# EAGLE schematic CLOCK_1 (EAGLE 9.2.2)
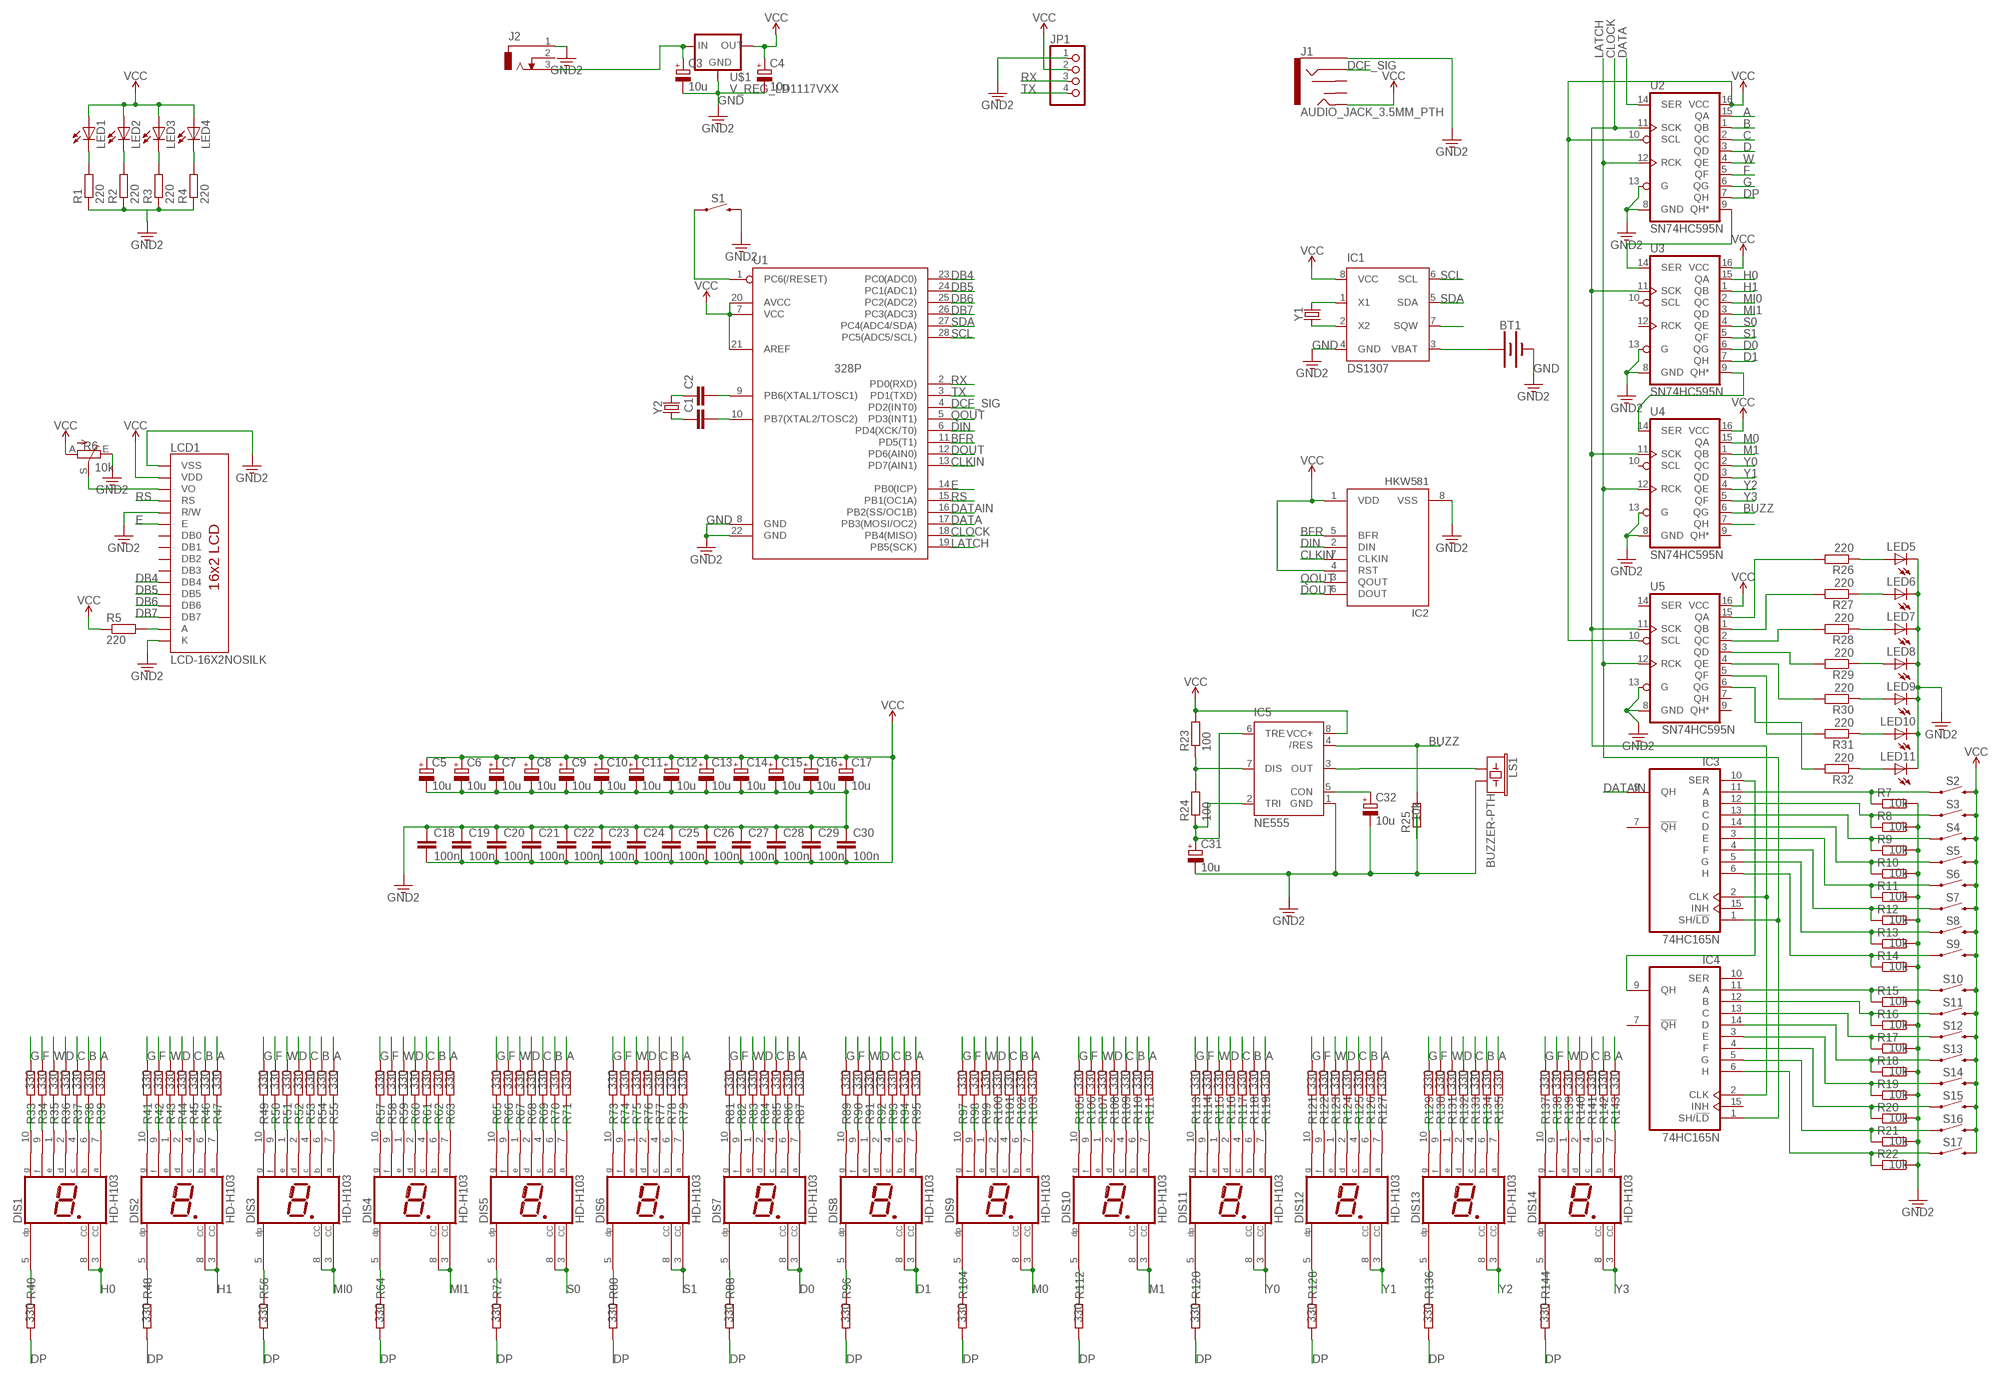
[diagram p0: schematic, sheet 1]

## Parts
BT1  BATTERY-20MM_PTH  [BATTCOM_20MM_PTH]
C1  C-EU025-025X050  [C025-025X050]
C2  C-EU025-025X050  [C025-025X050]
C3  10u  CPOL-EUE5-8.5  [E5-8,5]
C4  10u  CPOL-EUE5-8.5  [E5-8,5]
C5  10u  CPOL-EUE5-8.5  [E5-8,5]
C6  10u  CPOL-EUE5-8.5  [E5-8,5]
C7  10u  CPOL-EUE5-8.5  [E5-8,5]
C8  10u  CPOL-EUE5-8.5  [E5-8,5]
C9  10u  CPOL-EUE5-8.5  [E5-8,5]
C10  10u  CPOL-EUE5-8.5  [E5-8,5]
C11  10u  CPOL-EUE5-8.5  [E5-8,5]
C12  10u  CPOL-EUE5-8.5  [E5-8,5]
C13  10u  CPOL-EUE5-8.5  [E5-8,5]
C14  10u  CPOL-EUE5-8.5  [E5-8,5]
C15  10u  CPOL-EUE5-8.5  [E5-8,5]
C16  10u  CPOL-EUE5-8.5  [E5-8,5]
C17  10u  CPOL-EUE5-8.5  [E5-8,5]
C18  100n  C-EU025-025X050  [C025-025X050]
C19  100n  C-EU025-025X050  [C025-025X050]
C20  100n  C-EU025-025X050  [C025-025X050]
C21  100n  C-EU025-025X050  [C025-025X050]
C22  100n  C-EU025-025X050  [C025-025X050]
C23  100n  C-EU025-025X050  [C025-025X050]
C24  100n  C-EU025-025X050  [C025-025X050]
C25  100n  C-EU025-025X050  [C025-025X050]
C26  100n  C-EU025-025X050  [C025-025X050]
C27  100n  C-EU025-025X050  [C025-025X050]
C28  100n  C-EU025-025X050  [C025-025X050]
C29  100n  C-EU025-025X050  [C025-025X050]
C30  100n  C-EU025-025X050  [C025-025X050]
C31  10u  CPOL-EUE5-8.5  [E5-8,5]
C32  10u  CPOL-EUE5-8.5  [E5-8,5]
DIS1  HD-H103  [HDSP-M]
DIS2  HD-H103  [HDSP-M]
DIS3  HD-H103  [HDSP-M]
DIS4  HD-H103  [HDSP-M]
DIS5  HD-H103  [HDSP-M]
DIS6  HD-H103  [HDSP-M]
DIS7  HD-H103  [HDSP-M]
DIS8  HD-H103  [HDSP-M]
DIS9  HD-H103  [HDSP-M]
DIS10  HD-H103  [HDSP-M]
DIS11  HD-H103  [HDSP-M]
DIS12  HD-H103  [HDSP-M]
DIS13  HD-H103  [HDSP-M]
DIS14  HD-H103  [HDSP-M]
IC1  DS1307  [DIL08]
IC2  HKW581  MCP79412X/MSOP  [MSOP8_065]
IC3  74HC165N  [DIL16]
IC4  74HC165N  [DIL16]
IC5  NE555  [DIL-08]
J1  AUDIO_JACK_3.5MM_PTH  [AUDIO-JACK]
J2  DCJ0303  [DCJ0303]
JP1  PINHD-1X4  [1X04]
LCD1  LCD-16X2NOSILK  [LCD-16X2_NOSILK]
LED1  LED5MM  [LED5MM]
LED2  LED5MM  [LED5MM]
LED3  LED5MM  [LED5MM]
LED4  LED5MM  [LED5MM]
LED5  LED5MM  [LED5MM]
LED6  LED5MM  [LED5MM]
LED7  LED5MM  [LED5MM]
LED8  LED5MM  [LED5MM]
LED9  LED5MM  [LED5MM]
LED10  LED5MM  [LED5MM]
LED11  LED5MM  [LED5MM]
LS1  BUZZER-PTH  [BUZZER-12MM]
R1  220  R-EU_0207/10  [0207/10]
R2  220  R-EU_0207/10  [0207/10]
R3  220  R-EU_0207/10  [0207/10]
R4  220  R-EU_0207/10  [0207/10]
R5  220  R-EU_0207/10  [0207/10]
R6  10k  TRIM_EU-B25U  [B25U]
R7  10k  R-EU_0207/10  [0207/10]
R8  10k  R-EU_0207/10  [0207/10]
R9  10k  R-EU_0207/10  [0207/10]
R10  10k  R-EU_0207/10  [0207/10]
R11  10k  R-EU_0207/10  [0207/10]
R12  10k  R-EU_0207/10  [0207/10]
R13  10k  R-EU_0207/10  [0207/10]
R14  10k  R-EU_0207/10  [0207/10]
R15  10k  R-EU_0207/10  [0207/10]
R16  10k  R-EU_0207/10  [0207/10]
R17  10k  R-EU_0207/10  [0207/10]
R18  10k  R-EU_0207/10  [0207/10]
R19  10k  R-EU_0207/10  [0207/10]
R20  10k  R-EU_0207/10  [0207/10]
R21  10k  R-EU_0207/10  [0207/10]
R22  10k  R-EU_0207/10  [0207/10]
R23  100  R-EU_0207/10  [0207/10]
R24  100  R-EU_0207/10  [0207/10]
R25  10k  R-EU_0207/10  [0207/10]
R26  220  R-EU_0207/10  [0207/10]
R27  220  R-EU_0207/10  [0207/10]
R28  220  R-EU_0207/10  [0207/10]
R29  220  R-EU_0207/10  [0207/10]
R30  220  R-EU_0207/10  [0207/10]
R31  220  R-EU_0207/10  [0207/10]
R32  220  R-EU_0207/10  [0207/10]
R33  330  R-EU_0207/10  [0207/10]
R34  330  R-EU_0207/10  [0207/10]
R35  330  R-EU_0207/10  [0207/10]
R36  330  R-EU_0207/10  [0207/10]
R37  330  R-EU_0207/10  [0207/10]
R38  330  R-EU_0207/10  [0207/10]
R39  330  R-EU_0207/10  [0207/10]
R40  330  R-EU_0207/10  [0207/10]
R41  330  R-EU_0207/10  [0207/10]
R42  330  R-EU_0207/10  [0207/10]
R43  330  R-EU_0207/10  [0207/10]
R44  330  R-EU_0207/10  [0207/10]
R45  330  R-EU_0207/10  [0207/10]
R46  330  R-EU_0207/10  [0207/10]
R47  330  R-EU_0207/10  [0207/10]
R48  330  R-EU_0207/10  [0207/10]
R49  330  R-EU_0207/10  [0207/10]
R50  330  R-EU_0207/10  [0207/10]
R51  330  R-EU_0207/10  [0207/10]
R52  330  R-EU_0207/10  [0207/10]
R53  330  R-EU_0207/10  [0207/10]
R54  330  R-EU_0207/10  [0207/10]
R55  330  R-EU_0207/10  [0207/10]
R56  330  R-EU_0207/10  [0207/10]
R57  330  R-EU_0207/10  [0207/10]
R58  330  R-EU_0207/10  [0207/10]
R59  330  R-EU_0207/10  [0207/10]
R60  330  R-EU_0207/10  [0207/10]
R61  330  R-EU_0207/10  [0207/10]
R62  330  R-EU_0207/10  [0207/10]
R63  330  R-EU_0207/10  [0207/10]
R64  330  R-EU_0207/10  [0207/10]
R65  330  R-EU_0207/10  [0207/10]
R66  330  R-EU_0207/10  [0207/10]
R67  330  R-EU_0207/10  [0207/10]
R68  330  R-EU_0207/10  [0207/10]
R69  330  R-EU_0207/10  [0207/10]
R70  330  R-EU_0207/10  [0207/10]
R71  330  R-EU_0207/10  [0207/10]
R72  330  R-EU_0207/10  [0207/10]
R73  330  R-EU_0207/10  [0207/10]
R74  330  R-EU_0207/10  [0207/10]
R75  330  R-EU_0207/10  [0207/10]
R76  330  R-EU_0207/10  [0207/10]
R77  330  R-EU_0207/10  [0207/10]
R78  330  R-EU_0207/10  [0207/10]
R79  330  R-EU_0207/10  [0207/10]
R80  330  R-EU_0207/10  [0207/10]
R81  330  R-EU_0207/10  [0207/10]
R82  330  R-EU_0207/10  [0207/10]
R83  330  R-EU_0207/10  [0207/10]
R84  330  R-EU_0207/10  [0207/10]
R85  330  R-EU_0207/10  [0207/10]
R86  330  R-EU_0207/10  [0207/10]
R87  330  R-EU_0207/10  [0207/10]
R88  330  R-EU_0207/10  [0207/10]
R89  330  R-EU_0207/10  [0207/10]
R90  330  R-EU_0207/10  [0207/10]
R91  330  R-EU_0207/10  [0207/10]
R92  330  R-EU_0207/10  [0207/10]
R93  330  R-EU_0207/10  [0207/10]
R94  330  R-EU_0207/10  [0207/10]
R95  330  R-EU_0207/10  [0207/10]
R96  330  R-EU_0207/10  [0207/10]
R97  330  R-EU_0207/10  [0207/10]
R98  330  R-EU_0207/10  [0207/10]
R99  330  R-EU_0207/10  [0207/10]
R100  330  R-EU_0207/10  [0207/10]
R101  330  R-EU_0207/10  [0207/10]
R102  330  R-EU_0207/10  [0207/10]
R103  330  R-EU_0207/10  [0207/10]
R104  330  R-EU_0207/10  [0207/10]
R105  330  R-EU_0207/10  [0207/10]
R106  330  R-EU_0207/10  [0207/10]
R107  330  R-EU_0207/10  [0207/10]
R108  330  R-EU_0207/10  [0207/10]
R109  330  R-EU_0207/10  [0207/10]
R110  330  R-EU_0207/10  [0207/10]
R111  330  R-EU_0207/10  [0207/10]
R112  330  R-EU_0207/10  [0207/10]
R113  330  R-EU_0207/10  [0207/10]
R114  330  R-EU_0207/10  [0207/10]
R115  330  R-EU_0207/10  [0207/10]
R116  330  R-EU_0207/10  [0207/10]
R117  330  R-EU_0207/10  [0207/10]
R118  330  R-EU_0207/10  [0207/10]
R119  330  R-EU_0207/10  [0207/10]
R120  330  R-EU_0207/10  [0207/10]
R121  330  R-EU_0207/10  [0207/10]
R122  330  R-EU_0207/10  [0207/10]
R123  330  R-EU_0207/10  [0207/10]
R124  330  R-EU_0207/10  [0207/10]
R125  330  R-EU_0207/10  [0207/10]
R126  330  R-EU_0207/10  [0207/10]
R127  330  R-EU_0207/10  [0207/10]
R128  330  R-EU_0207/10  [0207/10]
R129  330  R-EU_0207/10  [0207/10]
R130  330  R-EU_0207/10  [0207/10]
R131  330  R-EU_0207/10  [0207/10]
R132  330  R-EU_0207/10  [0207/10]
R133  330  R-EU_0207/10  [0207/10]
R134  330  R-EU_0207/10  [0207/10]
R135  330  R-EU_0207/10  [0207/10]
R136  330  R-EU_0207/10  [0207/10]
R137  330  R-EU_0207/10  [0207/10]
R138  330  R-EU_0207/10  [0207/10]
R139  330  R-EU_0207/10  [0207/10]
R140  330  R-EU_0207/10  [0207/10]
R141  330  R-EU_0207/10  [0207/10]
R142  330  R-EU_0207/10  [0207/10]
R143  330  R-EU_0207/10  [0207/10]
R144  330  R-EU_0207/10  [0207/10]
S1  MOMENTARY-SWITCH-SPST-PTH-6.0MM  [TACTILE_SWITCH_PTH_6.0MM]
S2  MOMENTARY-SWITCH-SPST-PTH-6.0MM  [TACTILE_SWITCH_PTH_6.0MM]
S3  MOMENTARY-SWITCH-SPST-PTH-6.0MM  [TACTILE_SWITCH_PTH_6.0MM]
S4  MOMENTARY-SWITCH-SPST-PTH-6.0MM  [TACTILE_SWITCH_PTH_6.0MM]
S5  MOMENTARY-SWITCH-SPST-PTH-6.0MM  [TACTILE_SWITCH_PTH_6.0MM]
S6  MOMENTARY-SWITCH-SPST-PTH-6.0MM  [TACTILE_SWITCH_PTH_6.0MM]
S7  MOMENTARY-SWITCH-SPST-PTH-6.0MM  [TACTILE_SWITCH_PTH_6.0MM]
S8  MOMENTARY-SWITCH-SPST-PTH-6.0MM  [TACTILE_SWITCH_PTH_6.0MM]
S9  MOMENTARY-SWITCH-SPST-PTH-6.0MM  [TACTILE_SWITCH_PTH_6.0MM]
S10  MOMENTARY-SWITCH-SPST-PTH-6.0MM  [TACTILE_SWITCH_PTH_6.0MM]
S11  MOMENTARY-SWITCH-SPST-PTH-6.0MM  [TACTILE_SWITCH_PTH_6.0MM]
S12  MOMENTARY-SWITCH-SPST-PTH-6.0MM  [TACTILE_SWITCH_PTH_6.0MM]
S13  MOMENTARY-SWITCH-SPST-PTH-6.0MM  [TACTILE_SWITCH_PTH_6.0MM]
S14  MOMENTARY-SWITCH-SPST-PTH-6.0MM  [TACTILE_SWITCH_PTH_6.0MM]
S15  MOMENTARY-SWITCH-SPST-PTH-6.0MM  [TACTILE_SWITCH_PTH_6.0MM]
S16  MOMENTARY-SWITCH-SPST-PTH-6.0MM  [TACTILE_SWITCH_PTH_6.0MM]
S17  MOMENTARY-SWITCH-SPST-PTH-6.0MM  [TACTILE_SWITCH_PTH_6.0MM]
U1  328P  ATMEGA328P_PDIP  [DIP28]
U2  SN74HC595N  74HC595N  [DIP16]
U3  SN74HC595N  74HC595N  [DIP16]
U4  SN74HC595N  74HC595N  [DIP16]
U5  SN74HC595N  74HC595N  [DIP16]
U$1  V_REG_LD1117VXX  [78XXL]
Y1  CRYSTALPTH-2X6  [CRYSTAL-PTH-2X6-CYL]
Y2  CRYSTALPTH-HC49UV  [HC49U]

## Nets
3.3V: J1.SLEEVE ; supply symbol labelled GND2
A: R39.2 R47.2 R55.2 R63.2 R71.2 R79.2 R87.2 R95.2 R103.2 R111.2 R119.2 R127.2 R135.2 R143.2 U2.15(QA)
B: R38.2 R46.2 R54.2 R62.2 R70.2 R78.2 R86.2 R94.2 R102.2 R110.2 R118.2 R126.2 R134.2 R142.2 U2.1(QB)
BFR: IC2.5(BFR) U1.11(PD5(T1))
BUZZ: IC5.4(/RES) R25.2 U4.6(QG)
C: R37.2 R45.2 R53.2 R61.2 R69.2 R77.2 R85.2 R93.2 R101.2 R109.2 R117.2 R125.2 R133.2 R141.2 U2.2(QC)
CLKIN: IC2.7(CLKIN) U1.13(PD7(AIN1))
CLOCK: IC3.2(CLK) IC4.2(CLK) U1.18(PB4(MISO)) U2.11(SCK) U3.11(SCK) U4.11(SCK) U5.11(SCK)
D: R36.2 R44.2 R52.2 R60.2 R68.2 R76.2 R84.2 R92.2 R100.2 R108.2 R116.2 R124.2 R132.2 R140.2 U2.3(QD)
D0: DIS7.3(CC) DIS7.8(CC) U3.6(QG)
D1: DIS8.3(CC) DIS8.8(CC) U3.7(QH)
DATA: U1.17(PB3(MOSI/OC2)) U2.14(SER)
DATAIN: IC3.9(QH) U1.16(PB2(SS/OC1B))
DB4: LCD1.11(DB4) U1.23(PC0(ADC0))
DB5: LCD1.12(DB5) U1.24(PC1(ADC1))
DB6: LCD1.13(DB6) U1.25(PC2(ADC2))
DB7: LCD1.14(DB7) U1.26(PC3(ADC3))
DCF_SIG: J1.RING U1.4(PD2(INT0))
DIN: IC2.2(DIN) U1.6(PD4(XCK/T0))
DOUT: IC2.6(DOUT) U1.12(PD6(AIN0))
DP: R40.1 R48.1 R56.1 R64.1 R72.1 R80.1 R88.1 R96.1 R104.1 R112.1 R120.1 R128.1 R136.1 R144.1 U2.7(QH)
E: LCD1.6(E) U1.14(PB0(ICP))
F: R34.2 R42.2 R50.2 R58.2 R66.2 R74.2 R82.2 R90.2 R98.2 R106.2 R114.2 R122.2 R130.2 R138.2 U2.5(QF)
G: R33.2 R41.2 R49.2 R57.2 R65.2 R73.2 R81.2 R89.2 R97.2 R105.2 R113.2 R121.2 R129.2 R137.2 U2.6(QG)
GND: BT1.2(-) C3.- C4.- C5.- C6.- C7.- C8.- C9.- C10.- C11.- C12.- C13.- C14.- C15.- C16.- C17.- C18.1 C19.1 C20.1 C21.1 C22.1 C23.1 C24.1 C25.1 C26.1 C27.1 C28.1 C29.1 C30.1 C31.- C32.- IC1.4(GND) IC2.8(VSS) IC5.1(GND) J2.1 JP1.1 LCD1.1(VSS) LCD1.5(R/W) LCD1.16(K) LED5.K(C) LED6.K(C) LED7.K(C) LED8.K(C) LED9.K(C) LED10.K(C) LED11.K(C) LS1.- R1.1 R2.1 R3.1 R4.1 R6.E R7.2 R8.2 R9.2 R10.2 R11.2 R12.2 R13.2 R14.2 R15.2 R16.2 R17.2 R18.2 R19.2 R20.2 R21.2 R22.2 R25.1 S1.3 U1.8(GND) U1.22(GND) U2.8(GND) U2.13(G) U3.8(GND) U3.13(G) U4.8(GND) U4.13(G) U5.8(GND) U5.13(G) U$1.IN(GND) ; supply symbol labelled GND2
H0: DIS1.3(CC) DIS1.8(CC) U3.15(QA)
H1: DIS2.3(CC) DIS2.8(CC) U3.1(QB)
LATCH: IC3.1(SH/!LD) IC4.1(SH/!LD) U1.19(PB5(SCK)) U2.12(RCK) U4.12(RCK) U5.12(RCK)
M0: DIS9.3(CC) DIS9.8(CC) U4.15(QA)
M1: DIS10.3(CC) DIS10.8(CC) U4.1(QB)
MI0: DIS3.3(CC) DIS3.8(CC) U3.2(QC)
MI1: DIS4.3(CC) DIS4.8(CC) U3.3(QD)
N$1: C3.+ J2.3 U$1.OUT(IN)
N$2: LED3.K(C) R3.2
N$3: S1.1 U1.1(PC6(/RESET))
N$4: IC3.10(SER) IC4.9(QH)
N$5: LED1.K(C) R1.2
N$6: LED2.K(C) R2.2
N$7: IC1.1(X1) Y1.2
N$8: IC1.2(X2) Y1.1
N$9: LED4.K(C) R4.2
N$10: U2.9(QH*) U3.14(SER)
N$11: IC1.7(SQW)
N$12: BT1.1(+) IC1.3(VBAT)
N$13: C2.2 U1.9(PB6(XTAL1/TOSC1))
N$14: C1.2 U1.10(PB7(XTAL2/TOSC2))
N$15: C1.1 Y2.1
N$16: C2.1 Y2.2
N$17: U3.9(QH*) U4.14(SER)
N$19: IC3.11(A) R7.1 S2.1
N$20: IC3.12(B) R8.1 S3.1
N$21: LCD1.15(A) R5.2
N$22: IC3.13(C) R9.1 S4.1
N$23: IC3.14(D) R10.1 S5.1
N$24: IC3.3(E) R11.1 S6.1
N$25: IC3.4(F) R12.1 S7.1
N$26: IC3.5(G) R13.1 S8.1
N$27: IC3.6(H) R14.1 S9.1
N$28: IC4.11(A) R15.1 S10.1
N$29: IC4.12(B) R16.1 S11.1
N$30: IC4.13(C) R17.1 S12.1
N$31: IC4.14(D) R18.1 S13.1
N$32: LCD1.3(VO) R6.S
N$33: IC4.3(E) R19.1 S14.1
N$34: IC4.4(F) R20.1 S15.1
N$35: IC4.5(G) R21.1 S16.1
N$36: IC4.6(H) R22.1 S17.1
N$37: IC5.7(DIS) R23.1 R24.2
N$38: C31.+ IC5.2(TRI) IC5.6(TRE) R24.1
N$39: C32.+ IC5.5(CON)
N$41: R26.2 U5.15(QA)
N$42: IC5.3(OUT) LS1.+
N$43: R27.2 U5.1(QB)
N$44: R28.2 U5.2(QC)
N$45: R29.2 U5.3(QD)
N$46: R30.2 U5.4(QE)
N$47: R31.2 U5.5(QF)
N$48: R32.2 U5.6(QG)
N$49: LED5.A R26.1
N$50: LED6.A R27.1
N$51: LED7.A R28.1
N$52: LED8.A R29.1
N$53: LED9.A R30.1
N$54: LED10.A R31.1
N$55: LED11.A R32.1
N$57: DIS2.10(G) R41.1
N$58: DIS2.9(F) R42.1
N$59: DIS2.1(E) R43.1
N$60: DIS2.2(D) R44.1
N$61: DIS2.4(C) R45.1
N$62: DIS2.6(B) R46.1
N$63: DIS2.7(A) R47.1
N$64: DIS1.10(G) R33.1
N$65: DIS1.9(F) R34.1
N$66: DIS1.1(E) R35.1
N$67: DIS1.2(D) R36.1
N$68: DIS1.4(C) R37.1
N$69: DIS1.6(B) R38.1
N$70: DIS1.7(A) R39.1
N$71: DIS2.5(DP) R48.2
N$73: DIS3.10(G) R49.1
N$74: DIS3.9(F) R50.1
N$75: DIS3.1(E) R51.1
N$76: DIS3.2(D) R52.1
N$77: DIS3.4(C) R53.1
N$78: DIS1.5(DP) R40.2
N$79: DIS3.6(B) R54.1
N$80: DIS3.7(A) R55.1
N$81: DIS3.5(DP) R56.2
N$83: DIS4.10(G) R57.1
N$84: DIS4.9(F) R58.1
N$85: DIS4.1(E) R59.1
N$86: DIS4.2(D) R60.1
N$87: DIS4.4(C) R61.1
N$88: DIS4.6(B) R62.1
N$89: DIS4.7(A) R63.1
N$90: DIS4.5(DP) R64.2
N$92: DIS5.10(G) R65.1
N$93: DIS5.9(F) R66.1
N$94: DIS5.1(E) R67.1
N$95: DIS5.2(D) R68.1
N$96: DIS5.4(C) R69.1
N$97: DIS5.6(B) R70.1
N$98: DIS5.7(A) R71.1
N$99: DIS5.5(DP) R72.2
N$101: DIS6.10(G) R73.1
N$102: DIS6.9(F) R74.1
N$103: DIS6.1(E) R75.1
N$104: DIS6.2(D) R76.1
N$105: DIS6.4(C) R77.1
N$106: DIS6.6(B) R78.1
N$107: DIS6.7(A) R79.1
N$108: DIS6.5(DP) R80.2
N$110: DIS7.10(G) R81.1
N$111: DIS7.9(F) R82.1
N$112: DIS7.1(E) R83.1
N$113: DIS7.2(D) R84.1
N$114: DIS7.4(C) R85.1
N$115: DIS7.6(B) R86.1
N$116: DIS7.7(A) R87.1
N$117: DIS7.5(DP) R88.2
N$119: DIS8.10(G) R89.1
N$120: DIS8.9(F) R90.1
N$121: DIS8.1(E) R91.1
N$122: DIS8.2(D) R92.1
N$123: DIS8.4(C) R93.1
N$124: DIS8.6(B) R94.1
N$125: DIS8.7(A) R95.1
N$126: DIS8.5(DP) R96.2
N$128: DIS9.10(G) R97.1
N$129: DIS9.9(F) R98.1
N$130: DIS9.1(E) R99.1
N$131: DIS9.2(D) R100.1
N$132: DIS9.4(C) R101.1
N$133: DIS9.6(B) R102.1
N$134: DIS9.7(A) R103.1
N$135: DIS9.5(DP) R104.2
N$137: DIS10.10(G) R105.1
N$138: DIS10.9(F) R106.1
N$139: DIS10.1(E) R107.1
N$140: DIS10.2(D) R108.1
N$141: DIS10.4(C) R109.1
N$142: DIS10.6(B) R110.1
N$143: DIS10.7(A) R111.1
N$144: DIS10.5(DP) R112.2
N$146: DIS11.10(G) R113.1
N$147: DIS11.9(F) R114.1
N$148: DIS11.1(E) R115.1
N$149: DIS11.2(D) R116.1
N$150: DIS11.4(C) R117.1
N$151: DIS11.6(B) R118.1
N$152: DIS11.7(A) R119.1
N$153: DIS11.5(DP) R120.2
N$155: DIS12.10(G) R121.1
N$156: DIS12.9(F) R122.1
N$157: DIS12.1(E) R123.1
N$158: DIS12.2(D) R124.1
N$159: DIS12.4(C) R125.1
N$160: DIS12.6(B) R126.1
N$161: DIS12.7(A) R127.1
N$162: DIS12.5(DP) R128.2
N$164: DIS13.10(G) R129.1
N$165: DIS13.9(F) R130.1
N$166: DIS13.1(E) R131.1
N$167: DIS13.2(D) R132.1
N$168: DIS13.4(C) R133.1
N$169: DIS13.6(B) R134.1
N$170: DIS13.7(A) R135.1
N$171: DIS13.5(DP) R136.2
N$173: DIS14.10(G) R137.1
N$174: DIS14.9(F) R138.1
N$175: DIS14.1(E) R139.1
N$176: DIS14.2(D) R140.1
N$177: DIS14.4(C) R141.1
N$178: DIS14.6(B) R142.1
N$179: DIS14.7(A) R143.1
N$180: DIS14.5(DP) R144.2
N$197: U4.7(QH)
QOUT: IC2.3(QOUT) U1.5(PD3(INT1))
RS: LCD1.4(RS) U1.15(PB1(OC1A))
RX: JP1.3 U1.2(PD0(RXD))
S0: DIS5.3(CC) DIS5.8(CC) U3.4(QE)
S1: DIS6.3(CC) DIS6.8(CC) U3.5(QF)
SCL: IC1.6(SCL) U1.28(PC5(ADC5/SCL))
SDA: IC1.5(SDA) U1.27(PC4(ADC4/SDA))
TX: JP1.4 U1.3(PD1(TXD))
VCC: C4.+ C5.+ C6.+ C7.+ C8.+ C9.+ C10.+ C11.+ C12.+ C13.+ C14.+ C15.+ C16.+ C17.+ C18.2 C19.2 C20.2 C21.2 C22.2 C23.2 C24.2 C25.2 C26.2 C27.2 C28.2 C29.2 C30.2 IC1.8(VCC) IC2.1(VDD) IC2.4(RST) IC5.8(VCC+) J1.TIP JP1.2 LCD1.2(VDD) LED1.A LED2.A LED3.A LED4.A R5.1 R6.A R23.2 S2.3 S3.3 S4.3 S5.3 S6.3 S7.3 S8.3 S9.3 S10.3 S11.3 S12.3 S13.3 S14.3 S15.3 S16.3 S17.3 U1.7(VCC) U1.20(AVCC) U1.21(AREF) U2.10(SCL) U2.16(VCC) U3.16(VCC) U4.16(VCC) U5.10(SCL) U5.16(VCC) U$1.GND(OUT)
W: R35.2 R43.2 R51.2 R59.2 R67.2 R75.2 R83.2 R91.2 R99.2 R107.2 R115.2 R123.2 R131.2 R139.2 U2.4(QE)
Y0: DIS11.3(CC) DIS11.8(CC) U4.2(QC)
Y1: DIS12.3(CC) DIS12.8(CC) U4.3(QD)
Y2: DIS13.3(CC) DIS13.8(CC) U4.4(QE)
Y3: DIS14.3(CC) DIS14.8(CC) U4.5(QF)
Unconnected: IC3.7(!QH) IC3.15(INH) IC4.7(!QH) IC4.10(SER) IC4.15(INH) J1.RSH J1.TSH J2.2 LCD1.7(DB0) LCD1.8(DB1) LCD1.9(DB2) LCD1.10(DB3) U3.10(SCL) U3.12(RCK) U4.9(QH*) U4.10(SCL) U5.7(QH) U5.9(QH*) U5.14(SER)

## Power pins joined to a net without a drawn wire
GND: IC3.8(GND) IC4.8(GND)
VCC: IC3.16(VCC) IC4.16(VCC)

## Library data of the parts
BT1 = SparkFun-Batteries:BATTERY: Battery - Single Cell A variety of battery chemistries, sizes, and footprints. Device List: 20MM_PTH - Coin Cell Battery Holder - 20mm (PTH) <https://www.sparkfun.com/products/783> 6.8MM_PTH - Coin Cell Battery Holder - 6.8MM(SMD) <https://www.digikey.com/product-detail/en/seiko-instruments/MS621FE-FL11E/728-1057-ND/1889208?WT.srch=1&gclid=CNOQ5a6LzdQCFZS2wAodXCkE0g> 12MM_SMD - Coin Cell Battery Holder - 12mm (SMD) <https://www.sparkfun.com/products/10592> 12MM_PTH - Coin Cell Battery Holder - 12mm (PTH) <https://www.sparkfun.com/products/7948> 20MM_SMD - 20mm Coin Cell Battery Holder (SMD) (2 legs) Used on the Big Time Watch Kit <https://www.sparkfun.com/products/11734> 20MM_SMD_4LEGS - Coin Cell Battery Holder - 20mm (SMD) <https://www.sparkfun.com/products/11892> 20MM_SMD_4LEGS_OVERPASTE - Coin Cell Battery Holder - 20mm (SMD) <https://www.sparkfun.com/products/11892> (Over-paste on the legs) 24.5MM_PTH - Coin Cell Battery Holder - 24.5mm (PTH) <https://www.sparkfun.com/products/8863> 9V - 9V Battery Holder - PC Mount Used on the SparkFun SparkPunk Sound Kit <https://www.sparkfun.com/products/11177> and SparkFun SparkPunk Sequencer Kit <https://www.sparkfun.com/products/12707> 18650 - Battery Holder - 18650 (PTH) <https://www.sparkfun.com/products/13113> AA - Battery Holder - 1xAA (PTH) <https://www.sparkfun.com/products/7949> AAA - Battery Holder - 1xAAA (PTH) <https://www.sparkfun.com/products/12718> AA_KIT - Battery Holder - 1xAA (PTH) <https://www.sparkfun.com/products/7949> Special kit package - pads only have exposed copper on one side of the board. AAA_KIT - Battery Holder - 1xAAA (PTH) <https://www.sparkfun.com/products/12718> Special kit package - pads only have exposed copper on one side of the board.; PROD_ID: BATT-09031; SF_SKU: PRT-00783
C1 C2 C18-C30 = rcl:C-EU: CAPACITOR, European symbol; SPICEPREFIX: C
C3-C17 C31 C32 = rcl:CPOL-EU: POLARIZED CAPACITOR, European symbol; SPICEPREFIX: C
DIS1-DIS14 = display-hp:HD-H103: LED DISPLAY 1-character 7 segment, decimal point right; OC_FARNELL: unknown; OC_NEWARK: unknown
IC1 = ds1307_pcf8583:DS1307: I2C-Bus CLOCK/CALENDAR
IC2 = HKW581:MCP7941*?: Microchip MCP79410 / MCP79411 / MCP79412 I²C Real Time CLock/Calendar with Unique ID Rev. 5.0.0 as of 2013-10-23, for EAGLE 5+ Changelog 5.0.0 (initial) MCP79410XI/YY X: Unique ID 0: blank 1: EUI-48 2: EUI-96 I: Temperature Range (Industrial) /YY: Package /MS: MSOP8_.65 (8-Lead Micro Small Outline Package, 0.65mm pitch) /SN: SOIC8 (8-Lead Small Outline [Narrow], 3.9mm body) /ST: TSSOP8 (8-Lead Thin Schrink Small Outline, 4.4mm body) Source: http://www.microchip.com Author: Dipl.-Ing. FH Rainer Bayer Heilbronn University HHN http://www.hs-heilbronn.de/rainer.bayer · rainer.bayer@hs-heilbronn.de Engineering office ing-rb: http://www.ing-rb.de/ · eagle@ing-rb.de Lectureship dozent-rb: http://www.dozent-rb.de/ · eagle@dozent-rb.de; SPICEPREFIX: X
IC3 IC4 = 74xx-eu:74*165: 8-bit parallel load SHIFT REGISTER
IC5 = st-microelectronics:NE555: General purpose bipolar Timer; MF: Arrow Electronics; MPN: NE555N; OC_FARNELL: 1467742; OC_NEWARK: 89K1486
J1 = SparkFun-Connectors:AUDIO_JACK_3.5MM: Audio Jack 3.5mm variants of PTH and SMT stereo audio jack with bypass switches. SparkFun Products: SparkFun SparkPunk Sound Kit <[https://www.sparkfun.com/products/11177]> - PTH MP3 Trigger <https://www.sparkfun.com/products/13720> -3.5mm SMD SparkFun PicoBoard <https://www.sparkfun.com/products/11888>- 2.5mm SMD; PROD_ID: CONN-08774; SF_ID: PRT-08032
J2 = con-jack:DCJ0303: DC POWER JACK Source: DCJ0303.pdf; OC_FARNELL: unknown; OC_NEWARK: unknown
JP1 = pinhead:PINHD-1X4: PIN HEADER
LCD1 = SparkFun-Displays:LCD-16X2: Standard text-only 16x2 parallel input LCD Basic 16 character by 2 line display. Typically utilizes the extremely common HD44780 parallel interface chipset SparkFun Products: Basic 16x2 Green <https://www.sparkfun.com/products/255> Basic 8x2 Green <https://www.sparkfun.com/products/11122>; SF_ID: LCD-00255
LED1-LED11 = led:LED: LED OSRAM: - CHIPLED LG R971, LG N971, LY N971, LG Q971, LY Q971, LO R971, LY R971 LH N974, LH R974 LS Q976, LO Q976, LY Q976 LO Q996 - Hyper CHIPLED LW Q18S LB Q993, LB Q99A, LB R99A - SideLED LS A670, LO A670, LY A670, LG A670, LP A670 LB A673, LV A673, LT A673, LW A673 LH A674 LY A675 LS A676, LA A676, LO A676, LY A676, LW A676 LS A679, LY A679, LG A679 - Hyper Micro SIDELED® LS Y876, LA Y876, LO Y876, LY Y876 LT Y87S - SmartLED LW L88C, LW L88S LB L89C, LB L89S, LG L890 LS L89K, LO L89K, LY L89K LS L896, LA L896, LO L896, LY L896 - TOPLED LS T670, LO T670, LY T670, LG T670, LP T670 LSG T670, LSP T670, LSY T670, LOP T670, LYG T670 LG T671, LOG T671, LSG T671 LB T673, LV T673, LT T673, LW T673 LH T674 LS T676, LA T676, LO T676, LY T676, LB T676, LH T676, LSB T676, LW T676 LB T67C, LV T67C, LT T67C, LS T67K, LO T67K, LY T67K, LW E67C LS E67B, LA E67B, LO E67B, LY E67B, LB E67C, LV E67C, LT E67C LW T67C LS T679, LY T679, LG T679 LS T770, LO T770, LY T770, LG T770, LP T770 LB T773, LV T773, LT T773, LW T773 LH T774 LS E675, LA E675, LY E675, LS T675 LS T776, LA T776, LO T776, LY T776, LB T776 LHGB T686 LT T68C, LB T68C - Hyper Mini TOPLED® LB M676 - Mini TOPLED Santana® LG M470 LS M47K, LO M47K, LY M47K Source: http://www.osram.convergy.de LUXEON: - LUMILED® LXK2-PW12-R00, LXK2-PW12-S00, LXK2-PW14-U00, LXK2-PW14-V00 LXK2-PM12-R00, LXK2-PM12-S00, LXK2-PM14-U00 LXK2-PE12-Q00, LXK2-PE12-R00, LXK2-PE12-S00, LXK2-PE14-T00, LXK2-PE14-U00 LXK2-PB12-K00, LXK2-PB12-L00, LXK2-PB12-M00, LXK2-PB14-N00, LXK2-PB14-P00, LXK2-PB14-Q00 LXK2-PR12-L00, LXK2-PR12-M00, LXK2-PR14-Q00, LXK2-PR14-R00 LXK2-PD12-Q00, LXK2-PD12-R00, LXK2-PD12-S00 LXK2-PH12-R00, LXK2-PH12-S00 LXK2-PL12-P00, LXK2-PL12-Q00, LXK2-PL12-R00 Source: www.luxeon.com KINGBRIGHT: KA-3528ASYC Source: www.kingbright.com
LS1 = SparkFun-Electromechanical:BUZZER: Buzzer Small round buzzers that operate around the audible 2kHz range. You can use these as speakers to create simple music or user interfaces. Variant Overview: PTH - Mini Speaker - PC Mount 12mm 2.048kHz <https://www.sparkfun.com/products/7950> PTH_KIT - Mini Speaker - PC Mount 12mm 2.048kHz <https://www.sparkfun.com/products/7950> KIT simplifies soldering by adding stop mask to one side of the pads. PTH_NO_SILK - Mini Speaker - PC Mount 12mm 2.048kHz <https://www.sparkfun.com/products/7950> No silkscreen indicator of buzzer outline. PTH_KIT_NO_SILK - Mini Speaker - PC Mount 12mm 2.048kHz <https://www.sparkfun.com/products/7950> KIT package w/o silkscreen SMD - Buzzer Audio Magnetic (CCV-084B16) SMD buzzer used on, e.g. the LilyPad Buzzer <https://www.sparkfun.com/products/8463> and RFID USB Reader <https://www.sparkfun.com/products/9963>. SMD_KIT - Buzzer Audio Magnetic (CCV-084B16) SMD Buzzer with elongated pins to make soldering easier. Used on the SparkFun Simon Says - Surface Mount Soldering Kit <https://www.sparkfun.com/products/10935>.; PROD_ID: COMP-08253; SF_SKU: COM-07950
R1-R5 R23 R24 R26-R144 = rcl:R-EU_: RESISTOR, European symbol; SPICEPREFIX: R
R6 = pot:TRIM_EU-: POTENTIOMETER
R7-R22 R25 = resistor:R-EU_: RESISTOR, European symbol
S1-S17 = SparkFun-Switches:MOMENTARY-SWITCH-SPST: Momentary Switch (Pushbutton) - SPST Normally-open (NO) SPST momentary switches (buttons, pushbuttons). Variants PTH-12MM - 12mm square, through-hole Momentary Pushbutton Switch - 12mm Square <https://www.sparkfun.com/products/9190> (COM-09190) PTH-6.0MM, PTH-6.0MM-KIT - 6.0mm square, through-hole Mini Pushbutton Switch <https://www.sparkfun.com/products/97> (COM-00097) KIT package intended for soldering kit's - only one side of pads' copper is exposed. PTH-RIGHT-ANGLE-KIT - Right-angle, through-hole Right Angle Tactile Button <https://www.sparkfun.com/products/10791> - Used on SparkFun BigTime Watch Kit <https://www.sparkfun.com/products/11734> SMD-12MM - 12mm square, surface-mount Tactile Button - SMD (12mm) <https://www.sparkfun.com/products/12993> (COM-12993) Used on SparkFun PicoBoard <https://www.sparkfun.com/products/11888> SMD-4.5MM - 4.5mm Square Trackball Switch Used on SparkFun Blackberry Trackballer Breakout <https://www.sparkfun.com/products/13169> SMD-4.6MMX2.8MM - 4.60mm x 2.80mm, surface mount Used on SparkFun SAMD21 Mini Breakout <https://www.sparkfun.com/products/13664> SMD-5.2MM, SMD-5.2-REDUNDANT - 5.2mm square, surface-mount Mini Pushbutton Switch - SMD <https://www.sparkfun.com/products/8720> (COM-08720) Used on Arduino Pro Mini <https://www.sparkfun.com/products/11114> REDUNDANT package connects both switch circuits together SMD-6.0X3.5MM - 6.0 x 3.5mm, surface mount Momentary Reset Switch SMD <https://www.sparkfun.com/products/8229> (COM-08229) SMD-6.2MM-TALL - 6.2mm square, surface mount Tactile Button - SMD (6mm) <https://www.sparkfun.com/products/12992> Used on SparkFun Digital Sandbox <https://www.sparkfun.com/products/12651> SMD-RIGHT-ANGLE - Right-angle, surface mount Used on SparkFun Block for Intel® Edison - Arduino <https://www.sparkfun.com/products/13036>; PROD_ID: SWCH-08441; SF_SKU: COM-00097
U1 = SparkFun-IC-Microcontroller:ATMEGA328P_PDIP: Atmel 328P Through hole ATMEGA328P uC used in the Arduino 32kb flash, 1k EEPROM, 2k SRAM Datasheet <http://www.sparkfun.com/datasheets/Components/SMD/ATMega328.pdf> SparkFun Products Storefront component: AVR 28 Pin 20MHz 32K 6A/D - ATMega328P <https://www.sparkfun.com/products/9061> (COM-09061) SparkFun Simon Says - Through-Hole Soldering Kit <https://www.sparkfun.com/products/10547> (KIT-10547) SparkFun Learn to Solder - Simon Says <https://www.sparkfun.com/products/13708> (KIT-13708) SparkFun BigTime Watch Kit <https://www.sparkfun.com/products/11734> (KIT-11734) SparkFun ClockIt <https://www.sparkfun.com/products/10930> (KIT-10930) SparkFun Serial Enabled LCD Kit <https://www.sparkfun.com/products/10097> (LCD-10097) SparkFun Simon Tilts - Through Hole Soldering Kit <https://www.sparkfun.com/products/12634> (KIT-12634) SparkFun Frequency Counter Kit <https://www.sparkfun.com/products/10140> (KIT-10140) FabFM Radio Kit <https://www.sparkfun.com/products/11043> (KIT-11043) SparkFun Binary Blaster Kit <https://www.sparkfun.com/products/12037> (KIT-12037) SparkFun Metro-Gnome <https://www.sparkfun.com/products/9236> (KIT-09236) ATmega328 with Arduino Optiboot (Uno) <https://www.sparkfun.com/products/10524> (DEV-10524); PROD_ID: IC-09136
U2-U5 = SparkFun-IC-Logic:74*595: 8-Bit Shift Register (Serial to Parallel) Datasheet <http://cdn.sparkfun.com/datasheets/BreakoutBoards/MM74HC595.pdf> SparkFun Products SparkFun Shift Register Breakout - 74HC595 <https://www.sparkfun.com/products/10680> (BOB-10680); PROD_ID: IC-13123
U$1 = SparkFun-IC-Power:V_REG_LD1117VXX: LD1117VXX voltage regulator. We carry the 3.3V version (COM-00526) in TO-220 package.
Y1 Y2 = SparkFun-Clocks:CRYSTAL: Crystals (Generic) These are passive quartz crystals, which can be used as a clock source for a microcontroller. Crystal's are two-terminal devices. They require external "load" capacitors to generate an oscillating signal.